# EAGLE design IO4-Turtle (EAGLE 7.7.0)
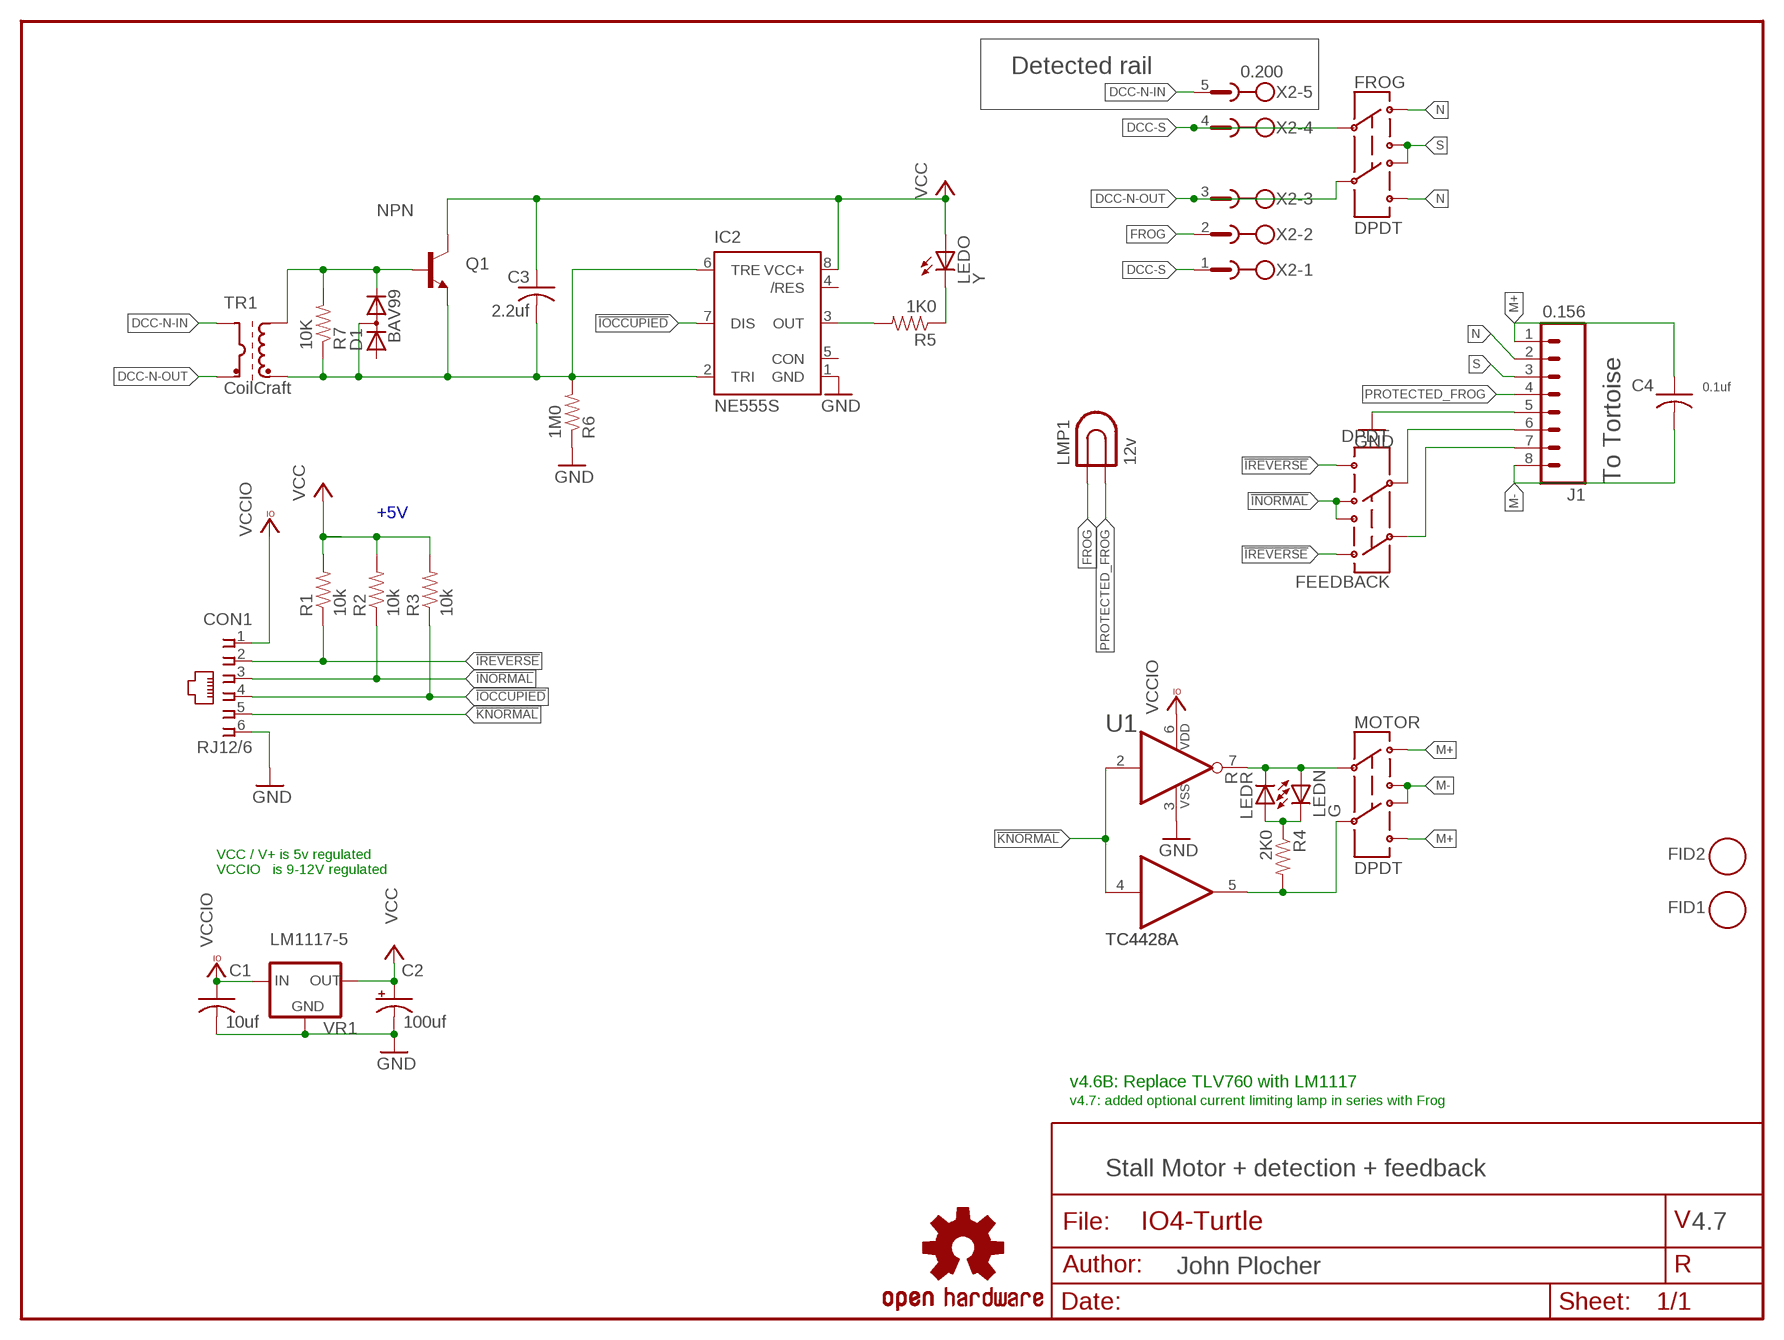
[diagram p0: schematic, sheet 1]

## Parts
C1  10uf  CAP0603  [0603-CAP]
C2  100uf  CAP-POLD  [PANASONIC_D]
C3  2.2uf  CAP0603  [0603-CAP]
C4  0.1uf  CAP0805  [0805-CAP]
CON1  RJ12/6  CONNECTOR-RJ25-43860-2-MOLEX  [RJ25-INVERTED]
D1  BAV99  DIODE-BAV199  [SOT23]
FEEDBACK  DPDT  SWITCH-DPDTPTH-PB  [8X8-SQ-PB]
FID1  FIDUCIAL  [FIDUCIAL_1MM]
FID2  FIDUCIAL  [FIDUCIAL_1MM]
FROG  DPDT  SWITCH-DPDTPTH-PB  [8X8-SQ-PB]
IC1  TC4428A  TC4428ACOASOIC  [SO-08]
IC2  NE555S  NE555D  [SO08]
J1  0.156  CONNECTOR-M081.56-F  [KK-156-8-F]
LEDN  G  LED0603-LED  [0603-LED]
LEDO  Y  LED0603-LED  [0603-LED]
LEDR  R  LED0603-LED  [0603-LED]
LMP1  12v  LAMPBULB  [BULB-3156]
MOTOR  DPDT  SWITCH-DPDTPTH-PB  [8X8-SQ-PB]
OSHW1  OSHW  DOC-OSHW-LOGO-M  [OSHW-LOGO-M]
Q1  NPN  NPN-SOT23  [SOT23]
R1  10k  R0603-RES  [0603-RES]
R2  10k  R0603-RES  [0603-RES]
R3  10k  R0603-RES  [0603-RES]
R4  2K0  R0603-RES  [0603-RES]
R5  1K0  R0603-RES  [0603-RES]
R6  1M0  R0603-RES  [0603-RES]
R7  10K  R0603-RES  [0603-RES]
TR1  CoilCraft  PULSE-TRANSFORMERPTH  [TH-T4]
VR1  LM1117-5  VREG-GOI-5  [SOT223]
X2  0.200  MSTBA5  [MSTBA5]

## Nets
!INORMAL: CON1.3 FEEDBACK.1B FEEDBACK.2A R2.1
!IOCCUPIED: CON1.4 IC2.7(DIS) R3.1
!IREVERSE: CON1.2 FEEDBACK.1A FEEDBACK.2B R1.1
!KNORMAL: CON1.5 IC1.2(I) IC1.4(I)
+12V: C1.1 CON1.1 IC1.6(VDD) VR1.3(IN) ; supply symbol labelled VCCIO
DCC-N-IN [DCC]: TR1.P1(DCC-A) X2.5
DCC-N-OUT [DCC]: FROG.2C TR1.P2(DCC-B) X2.3
DCC-S [DCC]: FROG.1C X2.1 X2.4
FROG [DCC]: LMP1.P$1 X2.2
GND [Power]: C1.2 C2.- CON1.6 IC1.3(VSS) IC2.1(GND) J1.5 R6.1 VR1.1(GND)
M+ [Power]: C4.1 J1.1 MOTOR.1A MOTOR.2B
M- [Power]: C4.2 J1.8 MOTOR.1B MOTOR.2A
N [DCC]: FROG.1A FROG.2B J1.2
N$1: IC1.7(O) LEDN.A LEDR.C MOTOR.1C
N$2 [Power]: D1.2(C) Q1.1(B) R7.2 TR1.S1(OUT-A)
N$3: LEDN.C LEDR.A R4.1
N$8: LEDO.C R5.1
N$9: IC2.3(OUT) R5.2
N$16: FEEDBACK.2C J1.6
N$17: FEEDBACK.1C J1.7
N$19 [Power]: IC1.5(O) MOTOR.2C R4.2
PROTECTED_FROG: J1.4 LMP1.P$2
S [DCC]: FROG.1B FROG.2A J1.3
TRIGGER: C3.2 D1.3(AC) IC2.2(TRI) IC2.6(TRE) Q1.2(E) R6.2 R7.1 TR1.S2(OUT-B)
V+ [Power]: C2.+ C3.1 IC2.8(VCC+) LEDO.A Q1.3(C) R1.2 R2.2 R3.2 VR1.2(OUT) VR1.4(OUT) ; supply symbol labelled VCC
Unconnected: D1.1(A) IC2.4(/RES) IC2.5(CON)

## Notes on the sheet
- Detected rail
- To Tortoise
- +5V
- U1
- VCC / V+ is 5v regulated
  VCCIO   is 9-12V regulated
- v4.6B: Replace TLV760 with LM1117
- v4.7: added optional current limiting lamp in series with Frog
- Stall Motor + detection + feedback
- 4.7
- John Plocher

## Library data of the parts
C1 C3 C4 = SPCoast:CAP*
C2 = SPCoast:CAP-POL*
CON1 = SPCoast:CONNECTOR-RJ25: AMP connector
D1 = SPCoast:DIODE-BAV199: DIODE low-leakage double diode
FEEDBACK FROG MOTOR = SPCoast:SWITCH-DPDT: DPDT Version of the COM-00597
FID1 FID2 = SPCoast:FIDUCIAL: For use by pick and place machines to calibrate the vision/machine, 1mm By microbuilder.eu
IC1 = SPCoast:TC4428A
IC2 = SPCoast:NE555: General purpose bipolar Timer
J1 = SPCoast:CONNECTOR-M08: Header 8 Standard 8-pin 0.1" header. Use with straight break away headers (SKU : PRT-00116), right angle break away headers (PRT-00553), swiss pins (PRT-00743), machine pins (PRT-00117), and female headers (PRT-00115).
LEDN LEDO LEDR = SPCoast:LED*
LMP1 = SPCoast:LAMP: LED HOLDER
OSHW1 = SPCoast:DOC-OSHW-LOGO-: Open Source Hardware Logo This logo indicates the piece of hardware it is found on incorporates a OSHW license and/or adheres to the definition of open source hardware http://freedomdefined.org/OSHW Creative Commons - Attribution - ShareAlike 3.0
Q1 = SPCoast:NPN: Transistor NPN BJT configuration in SOT23 package. MMBT2222 is the common NPN we use. Double check BCE configuration again layout.
R1-R7 = SPCoast:R*: Resistor Basic schematic elements and footprints for 0603, 1206, and PTH 1/10th watt (small) resistors.
TR1 = SPCoast:PULSE-TRANSFORMER: TRANSFORMER SMD wideband transformer
VR1 = SPCoast:VREG-?-*: Voltage Regulator Standard linear regulator. 7805 uses IGO pinout LM1117 uses GOI pinout
X2 = SPCoast:MSTBA5: PHOENIX; MPN: 1757271; OC_FARNELL: 3705201; OC_NEWARK: 71C4164

## Net classes
0 default: width 0.254 mm
1 Power: width 0.305 mm, clearance 0.254 mm
2 DCC: width 1.778 mm, drill 0.039 mm, clearance 0.254 mm

## Board
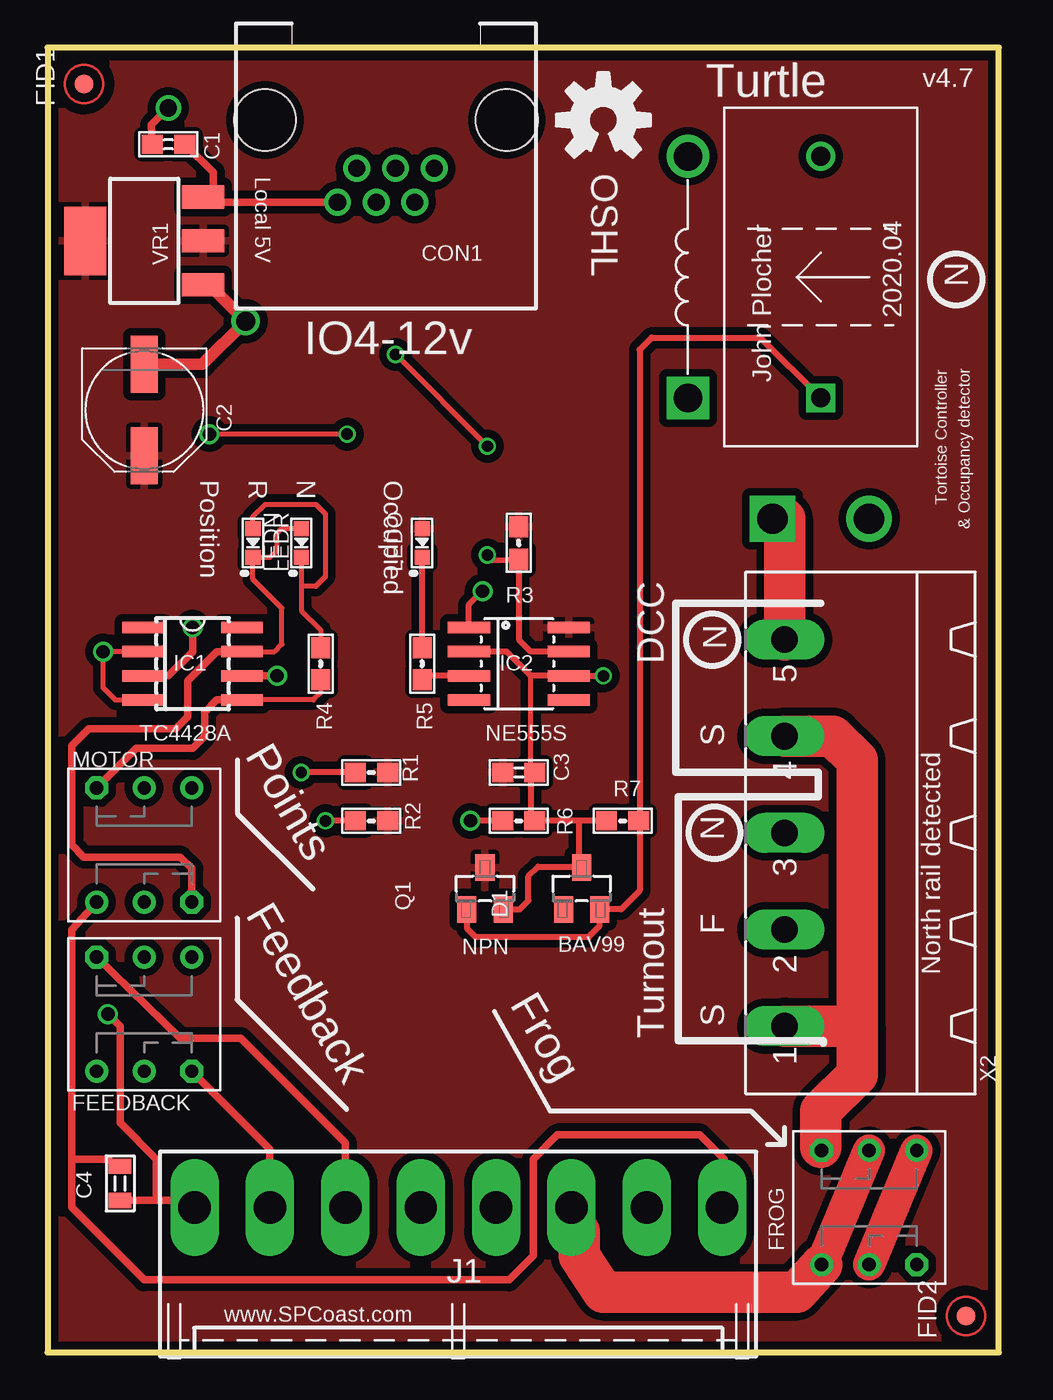
[diagram p1: board, top side]
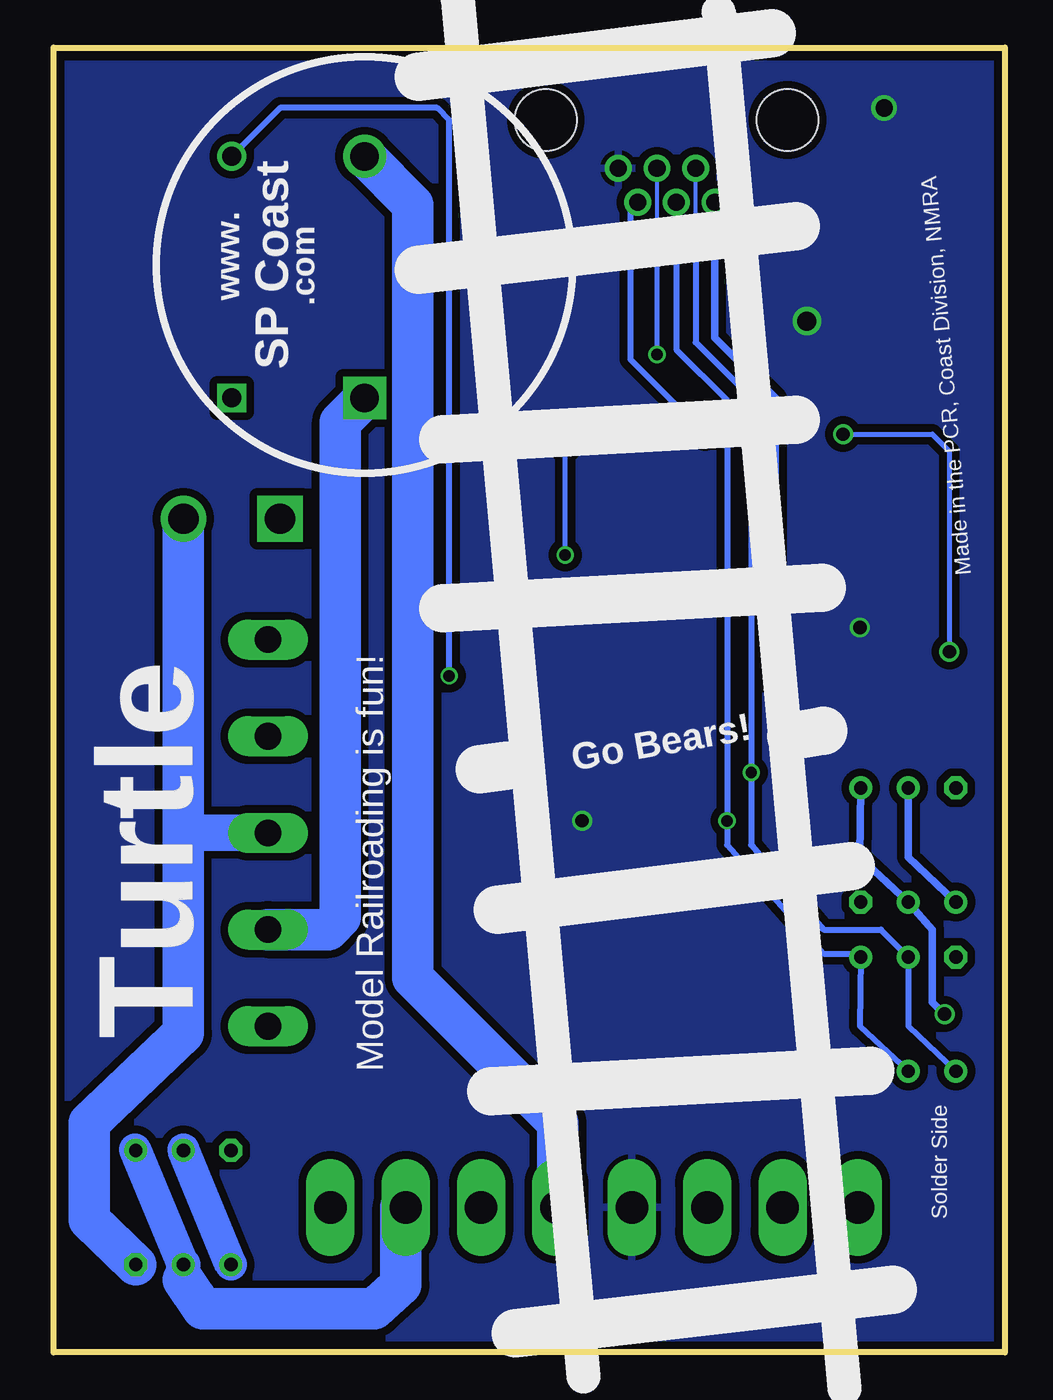
[diagram p2: board, bottom side, seen from below]

Size 50 x 68.58 mm. Coordinates in mm from the lower left corner, seen from the top.
Outline: 50,68.58 0,68.58 0,0 50,0 50,68.58
Copper layers (1*16): Top 0.035mm / dielectric 1.5mm / Bottom 0.035mm
Design rules "Fusion_eagle_rule_v1.1": minimum track width 6mil, minimum drill 12mil, track to track 6mil, track to pad 6mil, pad to pad 6mil, via to via 6mil, smd to smd 0mil, copper to edge 10mil, drill to drill 10mil, minimum pad ring 10mil, minimum via ring 6mil, stop-mask expansion 2mil, vias tented up to drill 100mil, thermal gap 10mil

### Footprints (pad centres in the part's own frame; a part is rotated, then mirrored left to right if it is on the bottom)
0603-CAP = smd 1.1 x 1: 1 -0.85,0; 2 0.85,0
PANASONIC_D = smd 3 x 1.4: + 2.4,0; - -2.4,0
0805-CAP = smd 0.8 x 1.2: 1 -0.9,0; 2 0.9,0
RJ25-INVERTED = drill 0.9 pad 1.4: 1 2.54,4.318; 2 1.524,2.54; 3 0.508,4.318; 4 -0.508,2.54; 5 -1.524,4.318; 6 -2.54,2.54 | hole 3.251: -6.35,0; 6.35,0
SOT23 = smd 1.4 x 1: 1 1.1,-0.95; 2 1.1,0.95; 3 -1.1,0
8X8-SQ-PB = drill 0.7: 1A 3,-2.5; 1B 3,0; 2A -3,2.5; 2B -3,0 | drill 0.7 octagon: 1C 3,2.5; 2C -3,-2.5
FIDUCIAL_1MM = smd 1 x 1: 1 0,0
SO-08 = smd 0.6 x 2.2: 1 -1.905,-2.6; 2 -0.635,-2.6; 3 0.635,-2.6; 4 1.905,-2.6; 5 1.905,2.6; 6 0.635,2.6; 7 -0.635,2.6; 8 -1.905,2.6
SO08 = smd 0.61 x 2.21: 1 -1.905,-2.616; 2 -0.635,-2.616; 3 0.635,-2.616; 4 1.905,-2.616; 5 1.905,2.616; 6 0.635,2.616; 7 -0.635,2.616; 8 -1.905,2.616
KK-156-8-F = drill 1.7 pad 2.184 long: 1 -13.86,0; 2 -9.9,0; 3 -5.94,0; 4 -1.98,0; 5 1.98,0; 6 5.94,0; 7 9.9,0; 8 13.86,0
0603-LED = smd 0.8 x 0.8: A 0.75,0; C -0.75,0
BULB-3156 = drill 1.5 square: P$1 -6.35,0 | drill 1.5: P$2 6.35,0
0603-RES = smd 1.1 x 1: 1 -0.85,0; 2 0.85,0
TH-T4 = drill 1.6 square: P1 -12.7,2.54 | drill 1.6: P2 -12.7,-2.54 | drill 1 square: S1 -6.35,0 | drill 1: S2 6.35,0
SOT223 = smd 1.219 x 2.235: 1 -2.311,-3.099; 2 0,-3.099; 3 2.311,-3.099 | smd 3.6 x 2.2: 4 0,3.099
MSTBA5 = drill 1.397 long: 1 -10.16,5.08; 2 -5.08,5.08; 3 0,5.08; 4 5.08,5.08; 5 10.16,5.08

### Placement (x,y rotation side)
C1  6.35,63.5 180 top
C2  5.08,49.53 270 top
C3  24.77,30.48 0 top
C4  3.81,8.89 270 top
CON1  17.78,64.77 180 top
D1  28.07,24.38 270 top
FEEDBACK  5.08,17.78 270 top
FID1  1.91,66.67 270 top
FID2  48.26,1.91 270 top
FROG  43.18,7.62 90 top
IC1  7.62,36.2 270 top
IC2  24.77,36.2 270 top
J1  21.59,7.62 180 top
LEDN  13.34,42.55 90 top
LEDO  19.68,42.55 90 top
LEDR  10.79,42.55 90 top
LMP1  33.66,56.52 90 top
MOTOR  5.08,26.67 270 top
OSHW1  29.21,64.77 0 top
Q1  22.99,24.38 270 top
R1  17.02,30.48 0 top
R2  17.02,27.94 0 top
R3  24.77,42.55 90 top
R4  14.35,36.2 270 top
R5  19.68,36.2 270 top
R6  24.77,27.94 0 top
R7  30.23,27.94 0 top
TR1  40.64,56.52 90 top
VR1  5.08,58.42 90 top
X2  43.81,27.3 90 top

### Tracks (layer width: path | path; a pad name or v marks a point on that pad's centre or on a via)
!INORMAL  (via drill 0.6)
  Top 0.305: R2.1 v14.61,27.94
  Bottom 0.305: FEEDBACK.1B 7.62,17.14 FEEDBACK.2A 7.75,20.95 9.53,20.95 14.61,26.67 v14.61,27.94 14.61,50.04 17.27,52.7 CON1.3
!IOCCUPIED  (via drill 0.6)
  Top 0.254: v18.29,52.45 v23.11,47.62
  Top 0.305: IC2.7 25.4,36.83 24.77,37.47 R3.1 23.38,41.65 v23.11,41.91
  Bottom 0.203: CON1.4 18.29,59.44
  Bottom 0.254: 18.29,59.44 v18.29,52.45 | v23.11,41.91 v23.11,47.62
!IREVERSE  (via drill 0.6)
  Top 0.305: R1.1 v13.34,30.48
  Bottom 0.203: 16.26,59.44 CON1.2
  Bottom 0.305: FEEDBACK.1A 5.08,17.14 FEEDBACK.2B 6.53,22.23 9.53,22.23 13.34,26.67 v13.34,30.48 13.34,50.16 16.26,53.09 16.26,59.44
!KNORMAL  (via drill 0.6, 0.7)
  Top 0.254: v15.75,48.26 v8.51,48.26 | IC1.4 3.56,34.29 2.92,34.92 v2.92,36.83 IC1.2
  Bottom 0.254: v8.51,48.26 3.81,48.26 2.92,47.37 v2.92,36.83
  Bottom 0.305: CON1.5 19.68,60.07 19.68,52.2 v15.75,48.26
+12V  (via drill 0.7)
  Top 0.406: 8.72,60.96 VR1.3 | CON1.1 8.85,60.45 8.72,60.96 | 8.72,60.96 8.72,62.03 C1.1 | IC1.6 v12.06,35.56
  Bottom 0.406: v12.06,35.56 12.06,50.16 15.24,53.34 CON1.1
DCC-N-IN
  Top 2.184: TR1.P1 38.73,43.81 X2.5
DCC-N-OUT
  Bottom 1.778: 42.55,27.3 43.18,27.94
  Bottom 1.93: X2.3 42.55,27.3
  Bottom 2.184: FROG.2C 48.13,6.99 48.13,12.06 43.18,16.76 43.18,27.94 TR1.P2
DCC-S
  Top 1.778: 40.64,10.79 FROG.1C
  Top 2.184: 42.55,17.14 42.55,31.11 41.27,32.38 X2.4 | 42.55,17.14 42.55,14.61 40.64,12.7 40.64,10.79 | X2.1 42.55,17.14
FROG
  Bottom 2.184: X2.2 35.56,22.23 34.92,22.86 34.92,48.9 LMP1.P$1
GND  (via drill 0.7, 0.9, 1)
  Top 0.254: 6.35,35.56 IC1.3
  Top 0.305: R6.1 v22.23,27.94 | IC2.1 22.15,39.29 v22.86,40.01
  Top 0.406: 6.35,35.56 7.62,36.83 v7.62,38.1 | v6.35,65.41 5.46,64.52 C1.2
  Top 0.61: VR1.1 8.51,56.11 v10.41,54.2 8.14,51.93 C2.-
  pour Bottom (isolate 0.406): 49.37,67.69 49.37,0.64 0.64,0.64 0.64,67.69
M+
  Top 0.406: 1.27,10.16 1.27,7.62 5.08,3.81 24.26,3.81 25.53,5.08 25.53,10.16 26.8,11.43 34.29,11.43 35.56,10.16 35.45,10.05 J1.1 | MOTOR.1A 1.27,22.23 1.27,10.16 | C4.1 3.17,10.16 1.27,10.16
  Bottom 0.406: MOTOR.2B 5.08,26.04 MOTOR.1A
M-  (via drill 0.7)
  Top 0.406: v3.17,17.78 3.81,17.14 3.81,12.06 5.71,10.16 5.71,8.26 5.67,7.99 | C4.2 5.67,7.99 | 5.67,7.99 7.36,7.99 J1.8
  Bottom 0.406: MOTOR.2A 7.62,26.04 MOTOR.1B 3.81,22.23 3.81,18.41 v3.17,17.78
N
  Top 1.676: FROG.2B FROG.1A
  Bottom 1.676: FROG.2B 45.72,10.67
  Bottom 1.778: 43.18,3.81 FROG.2B | J1.2 31.75,7.62
  Bottom 2.184: 31.75,7.62 31.75,3.56 33.15,2.29 42.16,2.29 43.18,3.81
N$1
  Top 0.254: IC1.7 11.94,36.83 12.32,37.21 12.32,39.12 10.79,40.64 LEDR.C 11.67,41.8 11.68,41.78 12.06,42.16 12.06,43.05 12.32,43.31 13.32,43.31 LEDN.A
  Top 0.406: MOTOR.1C 7.58,25.44 6.99,26.04 1.91,26.04 1.27,26.67 1.27,31.88 2.16,32.77 6.73,32.77 7.37,33.4 7.37,35.31 8.89,36.83 IC1.7
N$2
  Top 0.305: TR1.S1 37.47,53.34 31.75,53.34 31.11,52.7 31.11,27.94 | 31.11,27.94 R7.2 | 31.11,27.94 31.11,24.26 30.14,23.28 D1.2 29.02,22.41 28.45,21.84 22.48,21.84 22.04,22.29 Q1.1
N$3
  Top 0.254: LEDN.C 13.34,40.26 | 13.34,40.26 13.34,38.99 14.35,37.97 R4.1 | LEDR.A 10.79,43.94 11.43,44.58 14.1,44.58 14.61,44.07 14.61,40.77 14.1,40.26 13.34,40.26
N$8
  Top 0.305: R5.1 LEDO.C
N$9
  Top 0.305: IC2.3 20.05,35.56 R5.2
N$16
  Top 0.406: FEEDBACK.2C 6.99,16.51 10.16,16.51 15.65,11.02 J1.6
N$17
  Top 0.406: FEEDBACK.1C 11.69,10.67 J1.7
N$19
  Top 0.254: R4.2 14.35,34.67 13.97,34.29 IC1.5
  Top 0.406: MOTOR.2C 4.66,31.75 7.62,31.75 8.26,32.38 8.26,33.66 8.89,34.29 IC1.5
PROTECTED_FROG
  Bottom 1.778: J1.4 23.5,7.7
  Bottom 2.184: LMP1.P$2 31.11,60.33 31.11,19.68 23.5,12.06 23.5,7.7
S
  Top 1.676: FROG.2A FROG.1B
  Top 1.93: 27.53,6.76 27.94,6.35
  Top 2.184: 27.94,6.35 27.94,5.08 29.21,3.17 39.37,3.17 FROG.2A | J1.3 27.53,6.76
  Bottom 1.676: FROG.2A 43.18,10.67
TRIGGER  (via drill 0.6)
  Top 0.254: 25.4,35.56 25.4,30.48 25.66,30.75 C3.2 | 25.4,28.2 R6.2
  Top 0.305: IC2.2 24.13,36.83 25.4,35.56 IC2.6 v29.21,35.56 | 25.4,30.48 25.4,28.2 | R7.1 27.94,27.94 | 27.94,27.94 R6.2 25.4,27.68 | Q1.2 24.81,23.28 25.27,23.75 25.27,25.02 25.78,25.53 28.02,25.53 D1.3 27.94,25.61 27.94,27.94
  Bottom 0.305: v29.21,35.56 29.21,64.77 29.84,65.41 38.1,65.41 TR1.S2
V+
  pour Top (isolate 0.406): 49.37,67.69 49.37,0.64 0.64,0.64 0.64,67.69

### Text on the board
tPlace: Turtle | V4.7 | 2020-04 | Turtle | v4.7 | Local 5V | OSHL | 2020.04 | N | IO4-12v | John Plocher | Position | R | N | Occupied | Tortoise Controller | & Occupancy detector | N | DCC | TC4428A | NE555S | S | Points | N | Feedback | NPN | BAV99 | F | North rail detected | Frog | Turnout | S | www.SPCoast.com
bPlace: .com | www. | SP Coast | Made in the PCR, Coast Division, NMRA | Go Bears! | Turtle | Model Railroading is fun! | Solder Side
_tNames: C1 | C1 | CON1 | CON1 | VR1 | VR1 | C2 | C2 | LEDR | LEDR | LEDN | LEDN | LEDO | LEDO | R3 | R3 | IC1 | IC1 | IC2 | IC2 | R4 | R4 | R5 | R5 | MOTOR | MOTOR | R1 | R1 | C3 | C3 | R7 | R7 | R2 | R2 | R6 | R6 | Q1 | Q1 | D1 | D1 | X2 | X2 | FEEDBACK | FEEDBACK | C4 | C4 | FROG | FROG | J1 | J1